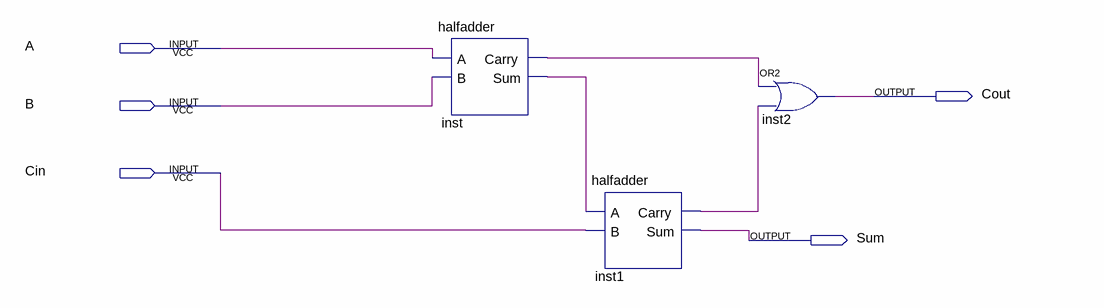
[diagram p0: schematic sheet]
// Quartus schematic fulladder.bdf as structural Verilog: 3 symbols, 5 pins
module fulladder (
  input  A,
  input  B,
  input  Cin,
  output Cout,
  output Sum
);

  wire inst1_carry, inst_carry, inst_sum;

  halfadder inst (.A(A), .B(B), .Carry(inst_carry), .Sum(inst_sum));
  halfadder inst1 (.A(inst_sum), .B(Cin), .Carry(inst1_carry), .Sum(Sum));
  or inst2 (Cout, inst_carry, inst1_carry);
endmodule
